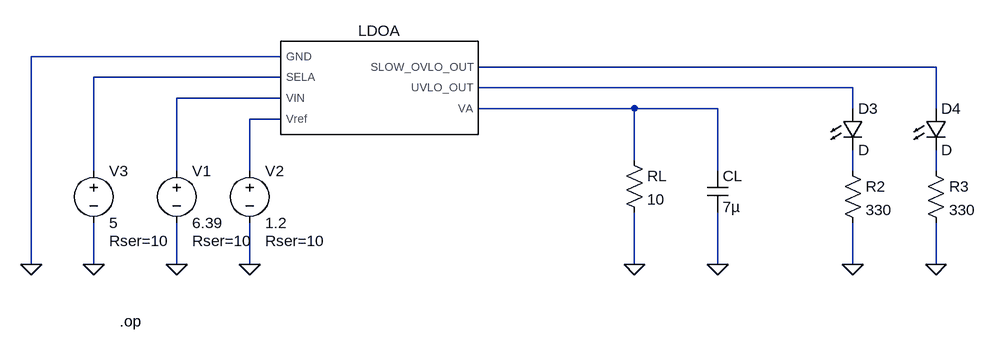
[diagram p0: schematic Regulador_LDOA_v10_con_symbol.asc]
Regulador_LDOA_v10_con_symbol.asc, the LTspice schematic file:
Version 4
SHEET 1 1156 736
WIRE 80 160 -304 160
WIRE 1088 176 384 176
WIRE 80 192 -208 192
WIRE 960 208 384 208
WIRE 80 224 -80 224
WIRE 624 240 384 240
WIRE 752 240 624 240
WIRE 960 240 960 208
WIRE 1088 240 1088 176
WIRE 80 256 32 256
WIRE 624 320 624 240
WIRE -208 336 -208 192
WIRE -80 336 -80 224
WIRE 32 336 32 256
WIRE 752 336 752 240
WIRE 960 336 960 304
WIRE 1088 336 1088 304
WIRE -304 480 -304 160
WIRE -208 480 -208 416
WIRE -80 480 -80 416
WIRE 32 480 32 416
WIRE 624 480 624 400
WIRE 752 480 752 400
WIRE 960 480 960 416
WIRE 1088 480 1088 416
FLAG 32 480 0
FLAG -80 480 0
FLAG -208 480 0
FLAG -304 480 0
FLAG 752 480 0
FLAG 624 480 0
FLAG 960 480 0
FLAG 1088 480 0
SYMBOL Regulador_LDOA_v9_symbol 224 208 R0
SYMATTR InstName LDOA
SYMBOL voltage -80 320 R0
WINDOW 123 0 0 Left 0
WINDOW 39 24 124 Left 2
SYMATTR InstName V1
SYMATTR Value 6.39
SYMATTR SpiceLine Rser=10
SYMBOL voltage 32 320 R0
WINDOW 123 0 0 Left 0
WINDOW 39 24 124 Left 2
SYMATTR InstName V2
SYMATTR Value 1.2
SYMATTR SpiceLine Rser=10
SYMBOL voltage -208 320 R0
WINDOW 123 0 0 Left 0
WINDOW 39 24 124 Left 2
SYMATTR InstName V3
SYMATTR Value 5
SYMATTR SpiceLine Rser=10
SYMBOL res 608 304 R0
SYMATTR InstName RL
SYMATTR Value 10
SYMBOL cap 736 336 R0
SYMATTR InstName CL
SYMATTR Value 7µ
SYMBOL res 944 320 R0
SYMATTR InstName R2
SYMATTR Value 330
SYMBOL res 1072 320 R0
SYMATTR InstName R3
SYMATTR Value 330
SYMBOL LED 944 240 R0
SYMATTR InstName D3
SYMBOL LED 1072 240 R0
SYMATTR InstName D4
TEXT -168 568 Left 2 !.op

The netlist it stands for:
* Regulador_LDOA_v10_con_symbol.asc
XLDOA 0 N002 N004 N006 N001 N003 N005 Regulador_LDOA_v9_symbol  ; pins GND SELA VIN Vref SLOW_OVLO_OUT UVLO_OUT VA
V1 N004 0 6.39 Rser=10
V2 N006 0 1.2 Rser=10
V3 N002 0 5 Rser=10
RL N005 0 10
CL N005 0 7µ
R2 N007 0 330
R3 N008 0 330
D3 N003 N007 D
D4 N001 N008 D
.model D D
.lib standard.dio
.op
.backanno
.end